# EAGLE design Nerv (EAGLE 5.11)
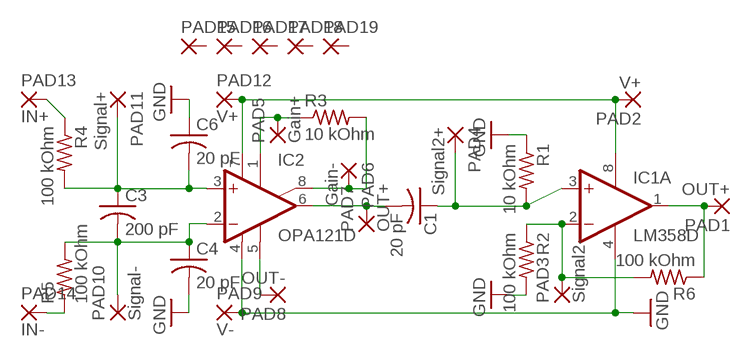
[diagram p0: schematic, sheet 1]

## Parts
C1  20 pF  C-USC0603  [C0603]
C3  200 pF  C-USC0603  [C0603]
C4  20 pF  C-USC0603  [C0603]
C6  20 pF  C-USC0603  [C0603]
IC1  LM358D  [SO08]
IC2  OPA121D  [SO08]
PAD1  OUT+  2,15/1,0  [2,15/1,0]
PAD2  V+  2,15/1,0  [2,15/1,0]
PAD3  Signal2-  2,15/1,0  [2,15/1,0]
PAD4  Signal2+  2,15/1,0  [2,15/1,0]
PAD5  Gain+  1,6/0,8  [1,4/0,8]
PAD6  Gain-  1,6/0,8  [1,6/0,8]
PAD7  OUT+  2,15/1,0  [2,15/1,0]
PAD8  OUT-  2,15/1,0  [2,15/1,0]
PAD9  V-  2,15/1,0  [2,15/1,0]
PAD10  Signal-  1,6/0,9  [1,6/0,9]
PAD11  Signal+  1,6/0,9  [1,6/0,9]
PAD12  V+  2,15/1,0  [2,15/1,0]
PAD13  IN+  2,15/1,0  [2,15/1,0]
PAD14  IN-  2,15/1,0  [2,15/1,0]
PAD15  1,6/0,8  [1,4/0,8]
PAD16  1,6/0,8  [1,4/0,8]
PAD17  1,6/0,8  [1,4/0,8]
PAD18  1,6/0,8  [1,4/0,8]
PAD19  1,6/0,8  [1,4/0,8]
R1  10 kOhm  R-US_R0603  [R0603]
R2  100 kOhm  R-US_R0603  [R0603]
R3  10 kOhm  R-US_R0603  [R0603]
R4  100 kOhm  R-US_R0603  [R0603]
R5  100 kOhm  R-US_R0603  [R0603]
R6  100 kOhm  R-US_R0603  [R0603]

## Nets
GND: C4.2 C6.1 IC1.4(P:V-) IC2.4(V-) PAD9.1(P) R1.1 R2.2
N$1: PAD13.1(P) R4.1
N$2: PAD14.1(P) R5.1
N$3: C3.2 C4.1 IC2.2(-IN) PAD10.1(P) R5.2
N$4: IC2.1(ON1) PAD5.1(P) R3.1
N$5: IC2.8(ON2) PAD6.1(P) R3.2
N$7: IC1.2(A:-IN) PAD3.1(P) R2.1 R6.2
N$8: IC2.5(OPT) PAD8.1(P)
N$10: IC1.1(A:OUT) PAD1.1(P) R6.1
N$11: C3.1 C6.2 IC2.3(+IN) PAD11.1(P) R4.2
N$12: IC1.8(P:V+) IC2.7(V+) PAD2.1(P) PAD12.1(P)
N$13: C1.1 IC1.3(A:+IN) PAD4.1(P) R1.2
N$17: C1.2 IC2.6(OUT) PAD7.1(P)
Unconnected: IC1.5(B:+IN) IC1.6(B:-IN) IC1.7(B:OUT) PAD15.1(P) PAD16.1(P) PAD17.1(P) PAD18.1(P) PAD19.1(P)

## Library data of the parts
C1 C3 C4 C6 = resistor:C-US: CAPACITOR, American symbol
IC1 = linear:LM358: OP AMP also LM158; LM258; LM2904 Source: http://cache.national.com/ds/LM/LM158.pdf
IC2 = linear:OPA121: OP AMP
PAD1-PAD4 PAD7-PAD9 PAD12-PAD14 = wirepad:2,15/1,0: THROUGH-HOLE PAD
PAD5 PAD15-PAD19 = wirepad2:1,6/0,8: THROUGH-HOLE PAD
PAD6 = wirepad:1,6/0,8: THROUGH-HOLE PAD
PAD10 PAD11 = wirepad:1,6/0,9: THROUGH-HOLE PAD
R1-R6 = resistor:R-US_: RESISTOR, American symbol

## Board
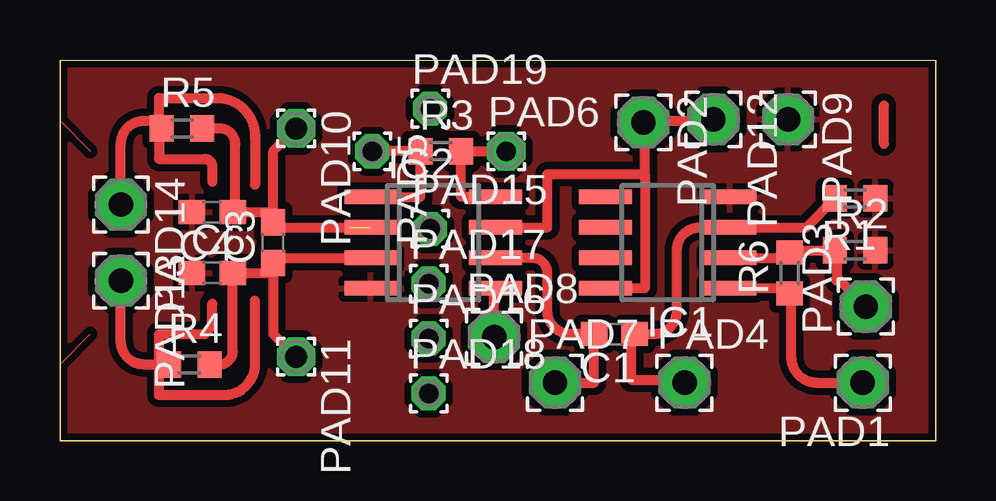
[diagram p1: board, top side]

Size 36.51 x 15.88 mm. Coordinates in mm from the lower left corner, seen from the top.
Outline: 36.5,15.86 36.5,0 0,0 0,15.86 36.51,15.88
Copper layers (1*16): Top 0.0356mm / dielectric 1.5011mm / Bottom 0.0356mm
Design rules "SparkFun-mod": minimum track width 8mil, minimum drill 20mil, track to track 12mil, track to pad 12mil, pad to pad 8mil, via to via 8mil, smd to smd 8mil, copper to edge 12mil, drill to drill 8mil, minimum pad ring 12mil, minimum via ring 10mil, stop-mask expansion 4mil, vias tented up to drill 25mil, thermal gap 10mil
Milling: 5 lines

### Footprints (pad centres in the part's own frame; a part is rotated, then mirrored left to right if it is on the bottom)
C0603 = smd 1.1 x 1: 1 -0.85,0; 2 0.85,0
SO08 = smd 0.6 x 2.2: 1 -1.905,-2.6; 2 -0.635,-2.6; 3 0.635,-2.6; 4 1.905,-2.6; 5 1.905,2.6; 6 0.635,2.6; 7 -0.635,2.6; 8 -1.905,2.6
2,15/1,0 = drill 1.016 pad 2.159 octagon: 1 0,0
1,4/0,8 = drill 0.813 pad 1.295 octagon: 1 0,0
1,6/0,8 = drill 0.813 pad 1.6 octagon: 1 0,0
1,6/0,9 = drill 0.914 pad 1.6 octagon: 1 0,0
R0603 = smd 1 x 1.1: 1 -0.85,0; 2 0.85,0

### Placement (x,y rotation side)
C1  23.11,4.45 180 top
C3  8.89,8.25 90 top
C4  6.35,9.52 180 top
C6  6.35,6.98 0 top
IC1  25.34,8.25 90 top
IC2  15.56,8.25 270 top
PAD1  33.46,2.41 180 top
PAD2  24.32,13.27 270 top
PAD3  33.59,5.59 90 top
PAD4  26.03,2.41 0 top
PAD5  13.02,12.06 270 top
PAD6  18.61,12.06 0 top
PAD7  20.64,2.41 0 top
PAD8  18.1,4.32 0 top
PAD9  30.35,13.4 270 top
PAD10  9.84,13.02 270 top
PAD11  9.84,3.49 270 top
PAD12  27.24,13.4 270 top
PAD13  2.54,6.67 270 top
PAD14  2.54,9.84 270 top
PAD15  15.43,8.83 0 top
PAD16  15.37,4.25 0 top
PAD17  15.37,6.54 0 top
PAD18  15.37,1.97 0 top
PAD19  15.43,13.84 0 top
R1  33.15,10.1 180 top
R2  33.15,7.94 0 top
R3  15.88,12.06 0 top
R4  5.4,3.17 0 top
R5  5.08,13.02 0 top
R6  30.42,6.98 90 top

### Tracks (layer width: path | path; a pad name or v marks a point on that pad's centre or on a via)
GND
  pour Top (isolate 0.254): 36.51,15.88 0,15.88 0,0 36.51,0
N$1
  Top 0.406: R4.1 3.49,3.17 arc-90 2.54,4.13 PAD13.1
N$2
  Top 0.406: 4.13,13.34 R5.1 | 4.13,13.34 4.13,11.75 6.03,11.75 arc-90 6.35,11.43 6.35,10.79 | 4.13,13.34 3.49,13.34 arc90 2.54,12.38 PAD14.1 | 4.13,13.34 4.13,14.29 6.67,14.29 arc-90 8.13,12.57 8.13,10.67
N$3  (1 unrouted)
  Top 0.406: 7.3,9.52 8.79,9.52 C3.2 8.89,9.21 | PAD10.1 8.89,12.06 8.89,9.21 | R5.2 6.67,13.02 arc-90 7.3,12.38 7.3,9.52 | C4.1 7.3,9.52 | 8.89,9.21 arc90 9.21,8.89 12.06,8.89
N$4
  Top 0.406: PAD5.1 R3.1 15.02,10.16 IC2.1
N$5
  Top 0.406: IC2.8 16.73,10.16 R3.2 16.83,12.06 PAD6.1
N$6
  Top 0.406: 34.35,12.38 34.35,13.97
N$7
  Top 0.406: IC1.2 29.84,7.62 R6.2 30.16,7.94 R2.1 32.39,7.3 32.39,6.67 32.51,6.67 PAD3.1
N$8
  Top 0.406: 18.41,6.29 IC2.5 18.1,6.35 PAD8.1
N$10
  Top 0.406: 30.48,6.07 arc90 R6.1 | PAD1.1 31.56,2.41 arc-90 30.48,3.49 30.48,6.07 | 30.48,6.07 arc90 R6.1 | IC1.1 30.42,6.35 R6.1
N$11
  Top 0.406: C3.1 8.79,6.98 C6.2 7.2,3.71 arc-90 6.67,3.17 R4.2 | IC2.3 9.1,7.62 C3.1 | C3.1 8.89,4.45 PAD11.1
N$12
  Top 0.406: IC2.7 20.32,8.89 20.32,11.11 24.38,11.11 | IC1.8 24.38,6.35 24.38,11.11 | 24.38,11.11 24.38,12.7 PAD2.1 24.45,13.34 26.35,13.34 PAD12.1
N$13
  Top 0.406: R1.2 31.12,8.89 IC1.3 26.67,8.89 arc90 25.72,7.94 25.72,5.4 arc-90 24.77,4.45 C1.1 23.81,4.45 23.81,2.54 26.03,2.54 PAD4.1
N$14
  Top 0: 0,13.34 1.27,12.06
N$15
  Top 0: 0,3.17 1.27,4.45
N$16
  Top 0.406: 4.13,2.86 4.13,4.45 6.03,4.45 6.35,4.76 6.35,5.71
N$17
  Top 0.406: IC2.6 19.69,7.62 arc-90 20.32,6.98 20.32,5.4 arc90 21.27,4.45 C1.2 22.26,2.41 PAD7.1
N$18
  Top 0.406: 4.13,3.17 4.13,1.91 6.67,1.91 arc90 8.13,3.05 8.13,5.84